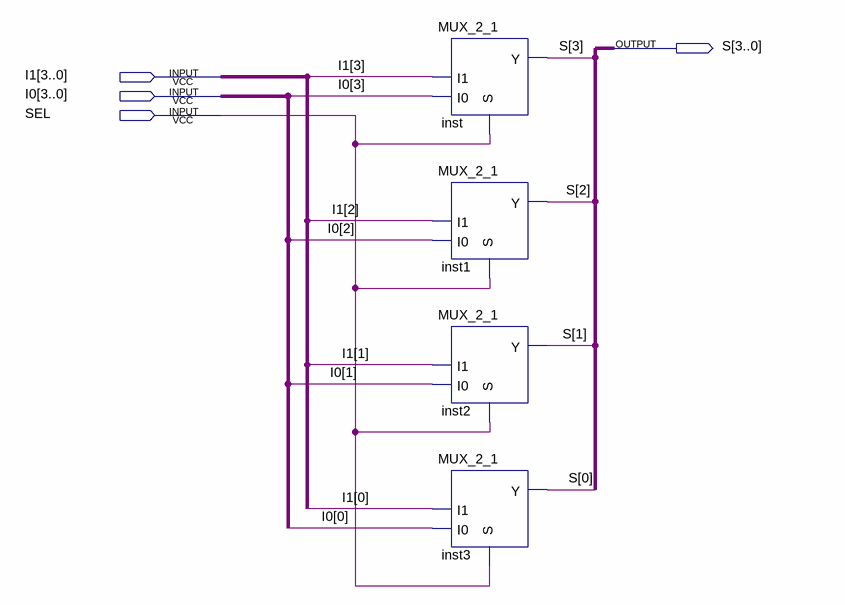
[diagram p0: schematic sheet]
// Quartus schematic MUX2_4BIT.bdf as structural Verilog: 4 symbols, 4 pins
module MUX2_4BIT (
  input  [3:0] I1,
  input  [3:0] I0,
  input  SEL,
  output [3:0] S
);

  MUX_2_1 inst (.S(SEL), .I1(I1[3]), .I0(I0[3]), .Y(S[3]));
  MUX_2_1 inst1 (.S(SEL), .I1(I1[2]), .I0(I0[2]), .Y(S[2]));
  MUX_2_1 inst2 (.S(SEL), .I1(I1[1]), .I0(I0[1]), .Y(S[1]));
  MUX_2_1 inst3 (.S(SEL), .I1(I1[0]), .I0(I0[0]), .Y(S[0]));
endmodule
